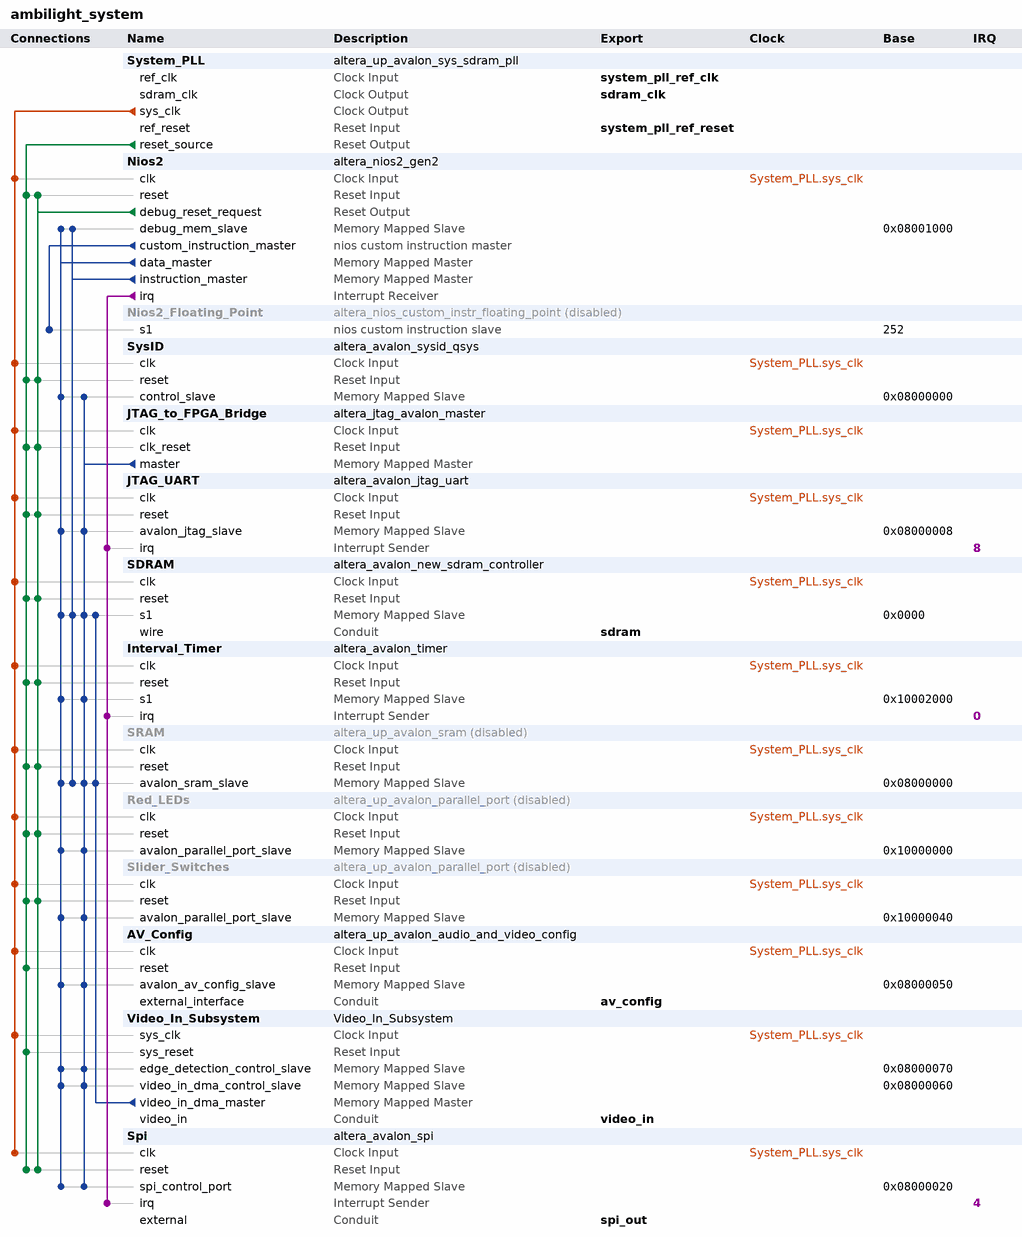
[diagram p0: system contents]
# Platform Designer (Qsys) system ambilight_system, Cyclone IV E EP4CE115F29C7
# Parameters at their usual value, and those the tool derives, are not listed.
package require -exact qsys 16.1
create_system ambilight_system
set_project_property DEVICE_FAMILY {Cyclone IV E}
set_project_property DEVICE EP4CE115F29C7

add_instance System_PLL altera_up_avalon_sys_sdram_pll 16.1
set_instance_parameter_value System_PLL CV_boards DE1-SoC
set_instance_parameter_value System_PLL gui_outclk 50.0
set_instance_parameter_value System_PLL gui_refclk 50.0

add_instance Nios2 altera_nios2_gen2 16.1
set_instance_parameter_value Nios2 dcache_size 0
set_instance_parameter_value Nios2 debug_datatrigger 2
set_instance_parameter_value Nios2 debug_hwbreakpoint 2
set_instance_parameter_value Nios2 debug_traceType instruction_trace
set_instance_parameter_value Nios2 dividerType srt2
set_instance_parameter_value Nios2 exceptionSlave SDRAM.s1
set_instance_parameter_value Nios2 icache_size 4096
set_instance_parameter_value Nios2 impl Tiny
set_instance_parameter_value Nios2 mul_64_impl 1
set_instance_parameter_value Nios2 mul_shift_choice 1
set_instance_parameter_value Nios2 resetSlave SDRAM.s1
set_instance_parameter_value Nios2 resetrequest_enabled false

add_instance Nios2_Floating_Point altera_nios_custom_instr_floating_point 16.1
set_instance_property Nios2_Floating_Point ENABLED false

add_instance SysID altera_avalon_sysid_qsys 16.1
set_instance_parameter_value SysID id 255

add_instance JTAG_to_FPGA_Bridge altera_jtag_avalon_master 16.1

add_instance JTAG_UART altera_avalon_jtag_uart 16.1
set_instance_parameter_value JTAG_UART simInteractiveOptions NO_INTERACTIVE_WINDOWS

add_instance SDRAM altera_avalon_new_sdram_controller 16.1
set_instance_parameter_value SDRAM TAC 5.5
set_instance_parameter_value SDRAM TRCD 20.0
set_instance_parameter_value SDRAM TRP 20.0
set_instance_parameter_value SDRAM casLatency 3
set_instance_parameter_value SDRAM columnWidth 10
set_instance_parameter_value SDRAM dataWidth 32
set_instance_parameter_value SDRAM generateSimulationModel true
set_instance_parameter_value SDRAM model single_Micron_MT48LC4M32B2_7_chip
set_instance_parameter_value SDRAM numberOfBanks 4
set_instance_parameter_value SDRAM numberOfChipSelects 1
set_instance_parameter_value SDRAM powerUpDelay 100.0
set_instance_parameter_value SDRAM refreshPeriod 15.625
set_instance_parameter_value SDRAM rowWidth 13

add_instance Interval_Timer altera_avalon_timer 16.1
set_instance_parameter_value Interval_Timer period 125.0
set_instance_parameter_value Interval_Timer periodUnits MSEC

add_instance SRAM altera_up_avalon_sram 16.1
set_instance_property SRAM ENABLED false
set_instance_parameter_value SRAM board DE2-115
set_instance_parameter_value SRAM pixel_buffer true

add_instance Red_LEDs altera_up_avalon_parallel_port 16.1
set_instance_property Red_LEDs ENABLED false
set_instance_parameter_value Red_LEDs board DE2-115
set_instance_parameter_value Red_LEDs capture false
set_instance_parameter_value Red_LEDs edge Rising
set_instance_parameter_value Red_LEDs irq false
set_instance_parameter_value Red_LEDs leds Red
set_instance_parameter_value Red_LEDs preset LEDs

add_instance Slider_Switches altera_up_avalon_parallel_port 16.1
set_instance_property Slider_Switches ENABLED false
set_instance_parameter_value Slider_Switches board DE2-115
set_instance_parameter_value Slider_Switches capture false
set_instance_parameter_value Slider_Switches edge Rising
set_instance_parameter_value Slider_Switches irq false
set_instance_parameter_value Slider_Switches preset {Slider Switches}

add_instance AV_Config altera_up_avalon_audio_and_video_config 16.1
set_instance_parameter_value AV_Config audio_in {Microphone to ADC}
set_instance_parameter_value AV_Config bit_length 32
set_instance_parameter_value AV_Config board DE2-115
set_instance_parameter_value AV_Config line_in_bypass true
set_instance_parameter_value AV_Config sampling_rate {48 kHz}

add_instance Video_In_Subsystem Video_In_Subsystem 1.0

add_instance Spi altera_avalon_spi 16.1
set_instance_parameter_value Spi clockPolarity 0
set_instance_parameter_value Spi dataWidth 24
set_instance_parameter_value Spi masterSPI true
set_instance_parameter_value Spi numberOfSlaves 1
set_instance_parameter_value Spi targetClockRate 1000000

# connections
add_connection System_PLL.sys_clk AV_Config.clk clock
add_connection System_PLL.sys_clk Interval_Timer.clk clock
add_connection System_PLL.sys_clk JTAG_to_FPGA_Bridge.clk clock
add_connection System_PLL.sys_clk JTAG_UART.clk clock
add_connection System_PLL.sys_clk Nios2.clk clock
add_connection System_PLL.sys_clk Red_LEDs.clk clock
add_connection System_PLL.sys_clk SDRAM.clk clock
add_connection System_PLL.sys_clk Slider_Switches.clk clock
add_connection System_PLL.sys_clk Spi.clk clock
add_connection System_PLL.sys_clk SRAM.clk clock
add_connection System_PLL.sys_clk SysID.clk clock
add_connection System_PLL.sys_clk Video_In_Subsystem.sys_clk clock
add_connection Nios2.debug_reset_request Interval_Timer.reset reset
add_connection Nios2.debug_reset_request JTAG_to_FPGA_Bridge.clk_reset reset
add_connection Nios2.debug_reset_request JTAG_UART.reset reset
add_connection Nios2.debug_reset_request Nios2.reset reset
add_connection Nios2.debug_reset_request Red_LEDs.reset reset
add_connection Nios2.debug_reset_request SDRAM.reset reset
add_connection Nios2.debug_reset_request Slider_Switches.reset reset
add_connection Nios2.debug_reset_request Spi.reset reset
add_connection Nios2.debug_reset_request SRAM.reset reset
add_connection Nios2.debug_reset_request SysID.reset reset
add_connection System_PLL.reset_source AV_Config.reset reset
add_connection System_PLL.reset_source Interval_Timer.reset reset
add_connection System_PLL.reset_source JTAG_to_FPGA_Bridge.clk_reset reset
add_connection System_PLL.reset_source JTAG_UART.reset reset
add_connection System_PLL.reset_source Nios2.reset reset
add_connection System_PLL.reset_source Red_LEDs.reset reset
add_connection System_PLL.reset_source SDRAM.reset reset
add_connection System_PLL.reset_source Slider_Switches.reset reset
add_connection System_PLL.reset_source Spi.reset reset
add_connection System_PLL.reset_source SRAM.reset reset
add_connection System_PLL.reset_source SysID.reset reset
add_connection System_PLL.reset_source Video_In_Subsystem.sys_reset reset
add_connection JTAG_to_FPGA_Bridge.master AV_Config.avalon_av_config_slave avalon
set_connection_parameter_value JTAG_to_FPGA_Bridge.master/AV_Config.avalon_av_config_slave baseAddress 0x08000050
add_connection JTAG_to_FPGA_Bridge.master Interval_Timer.s1 avalon
set_connection_parameter_value JTAG_to_FPGA_Bridge.master/Interval_Timer.s1 baseAddress 0x10002000
add_connection JTAG_to_FPGA_Bridge.master JTAG_UART.avalon_jtag_slave avalon
set_connection_parameter_value JTAG_to_FPGA_Bridge.master/JTAG_UART.avalon_jtag_slave baseAddress 0x08000008
add_connection JTAG_to_FPGA_Bridge.master Red_LEDs.avalon_parallel_port_slave avalon
set_connection_parameter_value JTAG_to_FPGA_Bridge.master/Red_LEDs.avalon_parallel_port_slave baseAddress 0x10000000
add_connection JTAG_to_FPGA_Bridge.master SDRAM.s1 avalon
set_connection_parameter_value JTAG_to_FPGA_Bridge.master/SDRAM.s1 baseAddress 0x0000
add_connection JTAG_to_FPGA_Bridge.master Slider_Switches.avalon_parallel_port_slave avalon
set_connection_parameter_value JTAG_to_FPGA_Bridge.master/Slider_Switches.avalon_parallel_port_slave baseAddress 0x10000040
add_connection JTAG_to_FPGA_Bridge.master Spi.spi_control_port avalon
set_connection_parameter_value JTAG_to_FPGA_Bridge.master/Spi.spi_control_port baseAddress 0x08000020
add_connection JTAG_to_FPGA_Bridge.master SRAM.avalon_sram_slave avalon
set_connection_parameter_value JTAG_to_FPGA_Bridge.master/SRAM.avalon_sram_slave baseAddress 0x08000000
add_connection JTAG_to_FPGA_Bridge.master SysID.control_slave avalon
set_connection_parameter_value JTAG_to_FPGA_Bridge.master/SysID.control_slave baseAddress 0x08000000
add_connection JTAG_to_FPGA_Bridge.master Video_In_Subsystem.edge_detection_control_slave avalon
set_connection_parameter_value JTAG_to_FPGA_Bridge.master/Video_In_Subsystem.edge_detection_control_slave baseAddress 0x08000070
add_connection JTAG_to_FPGA_Bridge.master Video_In_Subsystem.video_in_dma_control_slave avalon
set_connection_parameter_value JTAG_to_FPGA_Bridge.master/Video_In_Subsystem.video_in_dma_control_slave baseAddress 0x08000060
add_connection Nios2.data_master AV_Config.avalon_av_config_slave avalon
set_connection_parameter_value Nios2.data_master/AV_Config.avalon_av_config_slave baseAddress 0x08000050
add_connection Nios2.data_master Interval_Timer.s1 avalon
set_connection_parameter_value Nios2.data_master/Interval_Timer.s1 baseAddress 0x10002000
add_connection Nios2.data_master JTAG_UART.avalon_jtag_slave avalon
set_connection_parameter_value Nios2.data_master/JTAG_UART.avalon_jtag_slave baseAddress 0x08000008
add_connection Nios2.data_master Nios2.debug_mem_slave avalon
set_connection_parameter_value Nios2.data_master/Nios2.debug_mem_slave baseAddress 0x08001000
add_connection Nios2.data_master Red_LEDs.avalon_parallel_port_slave avalon
set_connection_parameter_value Nios2.data_master/Red_LEDs.avalon_parallel_port_slave baseAddress 0x10000000
add_connection Nios2.data_master SDRAM.s1 avalon
set_connection_parameter_value Nios2.data_master/SDRAM.s1 baseAddress 0x0000
add_connection Nios2.data_master Slider_Switches.avalon_parallel_port_slave avalon
set_connection_parameter_value Nios2.data_master/Slider_Switches.avalon_parallel_port_slave baseAddress 0x10000040
add_connection Nios2.data_master Spi.spi_control_port avalon
set_connection_parameter_value Nios2.data_master/Spi.spi_control_port baseAddress 0x08000020
add_connection Nios2.data_master SRAM.avalon_sram_slave avalon
set_connection_parameter_value Nios2.data_master/SRAM.avalon_sram_slave baseAddress 0x08000000
add_connection Nios2.data_master SysID.control_slave avalon
set_connection_parameter_value Nios2.data_master/SysID.control_slave baseAddress 0x08000000
add_connection Nios2.data_master Video_In_Subsystem.edge_detection_control_slave avalon
set_connection_parameter_value Nios2.data_master/Video_In_Subsystem.edge_detection_control_slave baseAddress 0x08000070
add_connection Nios2.data_master Video_In_Subsystem.video_in_dma_control_slave avalon
set_connection_parameter_value Nios2.data_master/Video_In_Subsystem.video_in_dma_control_slave baseAddress 0x08000060
add_connection Nios2.instruction_master Nios2.debug_mem_slave avalon
set_connection_parameter_value Nios2.instruction_master/Nios2.debug_mem_slave baseAddress 0x08001000
add_connection Nios2.instruction_master SDRAM.s1 avalon
set_connection_parameter_value Nios2.instruction_master/SDRAM.s1 baseAddress 0x0000
add_connection Nios2.instruction_master SRAM.avalon_sram_slave avalon
set_connection_parameter_value Nios2.instruction_master/SRAM.avalon_sram_slave baseAddress 0x08000000
add_connection Video_In_Subsystem.video_in_dma_master SDRAM.s1 avalon
set_connection_parameter_value Video_In_Subsystem.video_in_dma_master/SDRAM.s1 baseAddress 0x0000
add_connection Video_In_Subsystem.video_in_dma_master SRAM.avalon_sram_slave avalon
set_connection_parameter_value Video_In_Subsystem.video_in_dma_master/SRAM.avalon_sram_slave baseAddress 0x08000000
add_connection Nios2.irq Interval_Timer.irq interrupt
set_connection_parameter_value Nios2.irq/Interval_Timer.irq irqNumber 0
add_connection Nios2.irq JTAG_UART.irq interrupt
set_connection_parameter_value Nios2.irq/JTAG_UART.irq irqNumber 8
add_connection Nios2.irq Spi.irq interrupt
set_connection_parameter_value Nios2.irq/Spi.irq irqNumber 4
add_connection Nios2.custom_instruction_master Nios2_Floating_Point.s1 nios_custom_instruction
set_connection_parameter_value Nios2.custom_instruction_master/Nios2_Floating_Point.s1 CIName nios2_floating_point
set_connection_parameter_value Nios2.custom_instruction_master/Nios2_Floating_Point.s1 baseAddress 252

# exported interfaces
add_interface av_config conduit end
set_interface_property av_config EXPORT_OF AV_Config.external_interface
add_interface sdram conduit end
set_interface_property sdram EXPORT_OF SDRAM.wire
add_interface sdram_clk clock source
set_interface_property sdram_clk EXPORT_OF System_PLL.sdram_clk
add_interface spi_out conduit end
set_interface_property spi_out EXPORT_OF Spi.external
add_interface system_pll_ref_clk clock sink
set_interface_property system_pll_ref_clk EXPORT_OF System_PLL.ref_clk
add_interface system_pll_ref_reset reset sink
set_interface_property system_pll_ref_reset EXPORT_OF System_PLL.ref_reset
add_interface video_in conduit end
set_interface_property video_in EXPORT_OF Video_In_Subsystem.video_in

set_interconnect_requirement {$system} qsys_mm.clockCrossingAdapter HANDSHAKE
set_interconnect_requirement {$system} qsys_mm.enableEccProtection FALSE
set_interconnect_requirement {$system} qsys_mm.insertDefaultSlave FALSE
set_interconnect_requirement {$system} qsys_mm.maxAdditionalLatency 1

save_system ambilight_system.qsys
